# EAGLE design Maze (EAGLE 9.7.0)
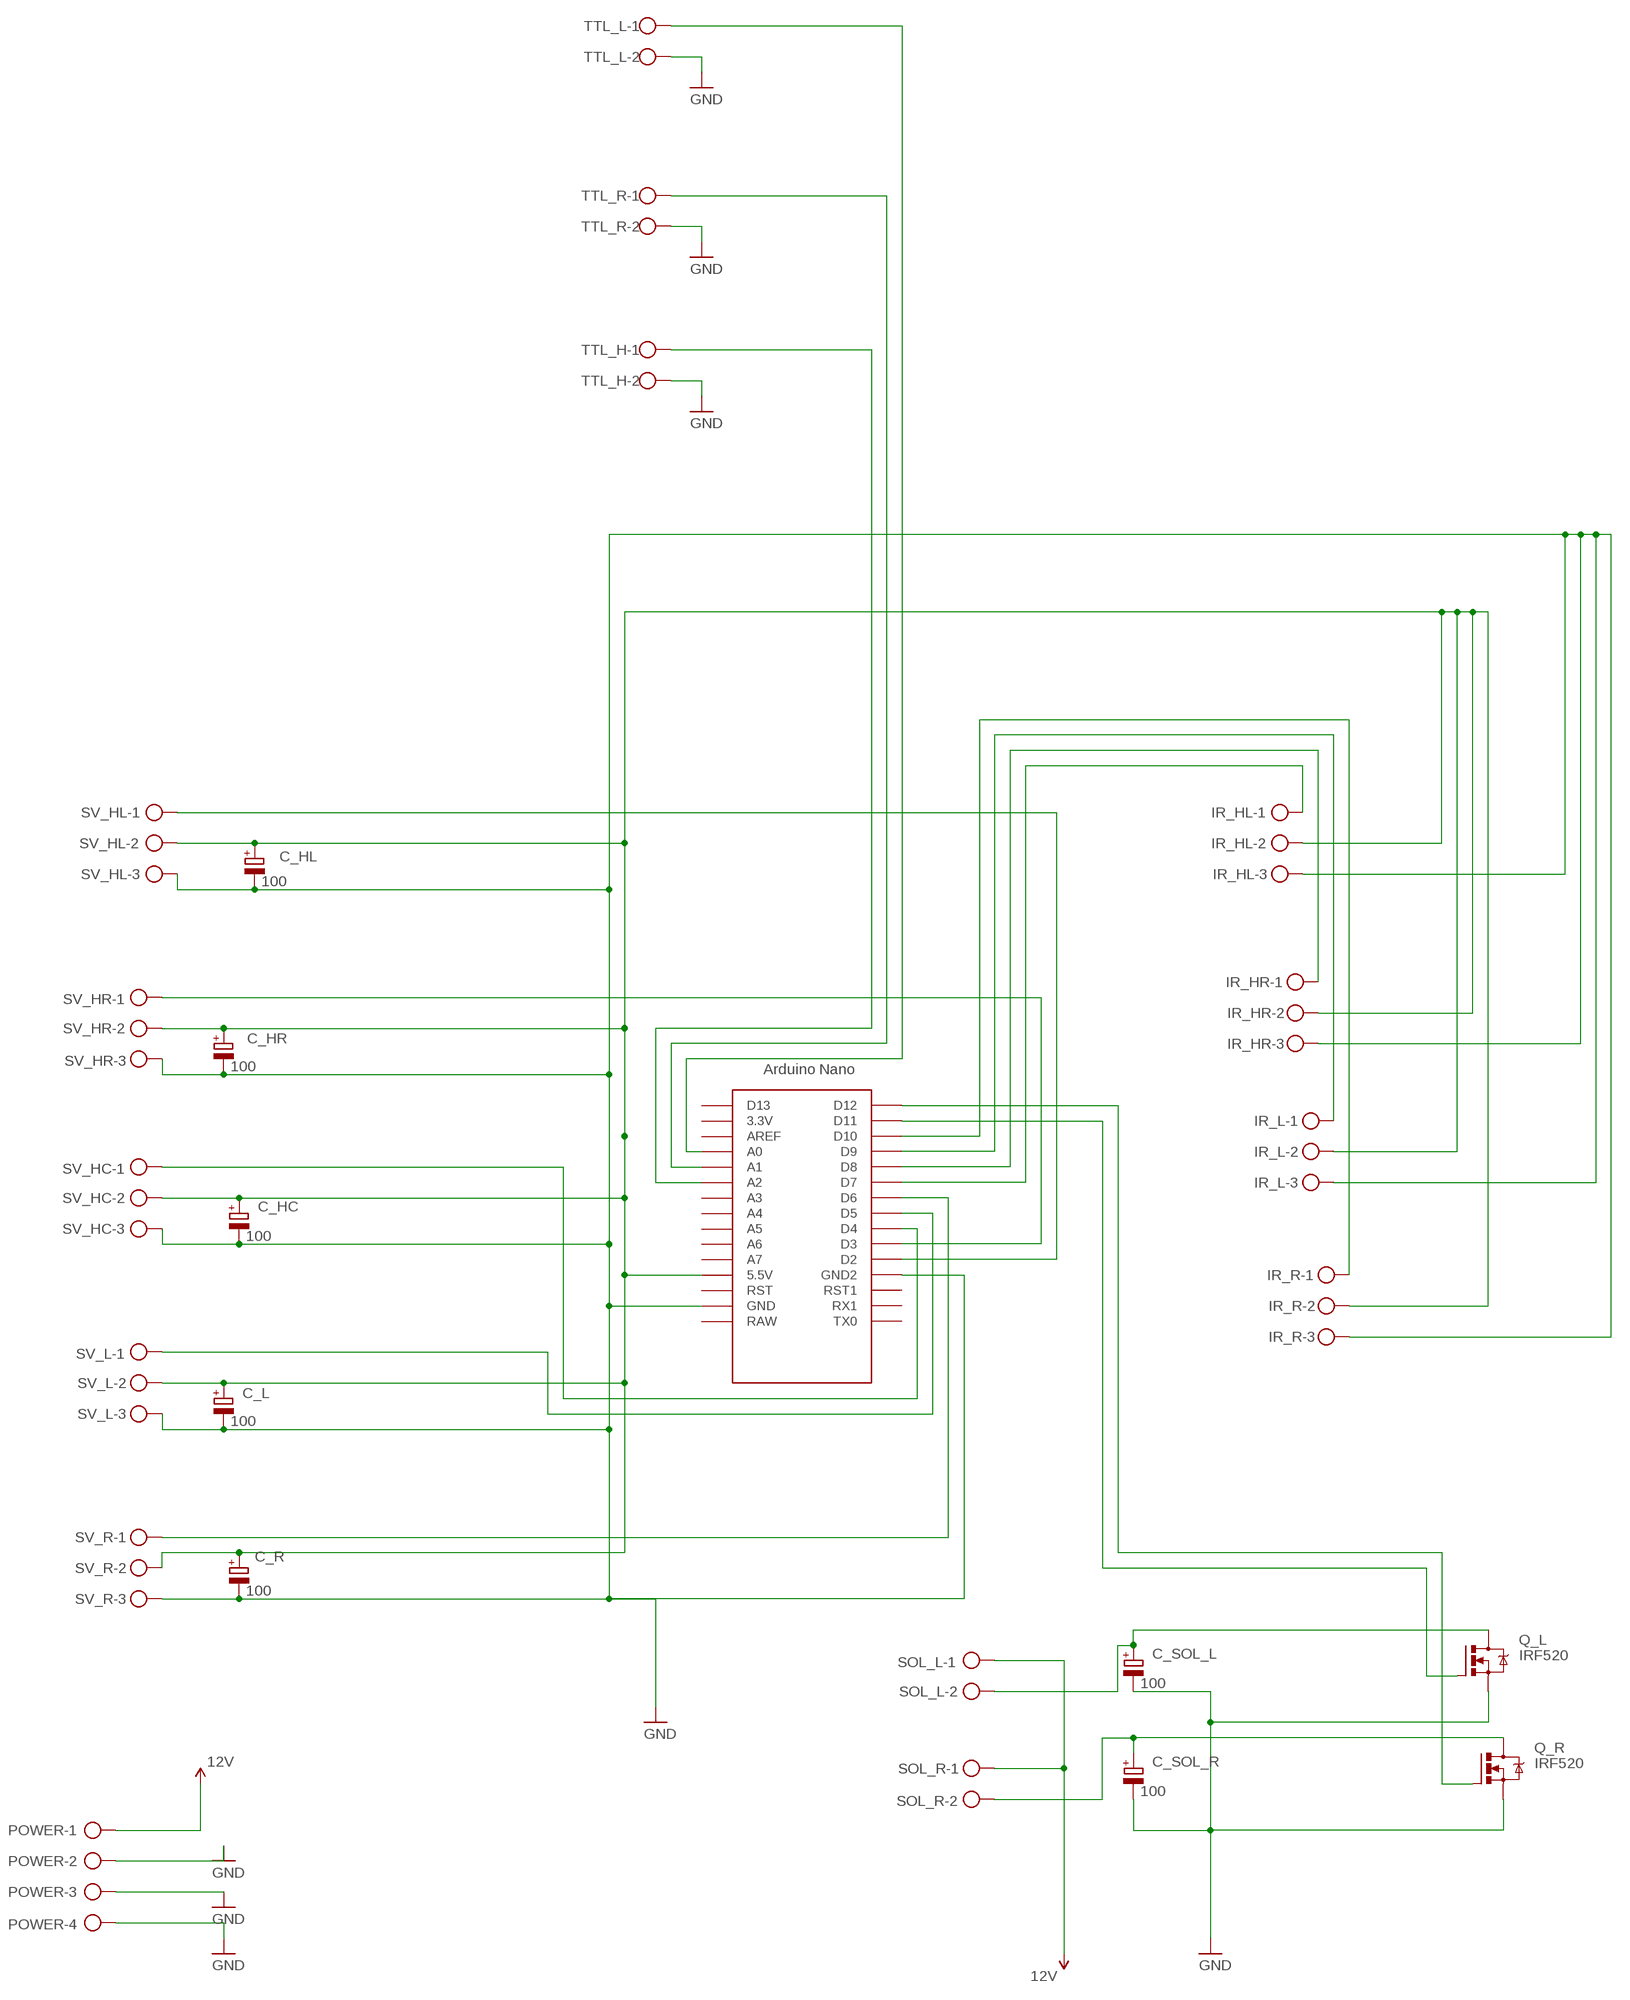
[diagram p0: schematic, sheet 1]

## Parts
C_HC  100  CPOL-EUE2.5-6  [E2,5-6]
C_HL  100  CPOL-EUE2.5-6  [E2,5-6]
C_HR  100  CPOL-EUE2.5-6  [E2,5-6]
C_L  100  CPOL-EUE2.5-6  [E2,5-6]
C_R  100  CPOL-EUE2.5-6  [E2,5-6]
C_SOL_L  100  CPOL-EUE2.5-6  [E2,5-6]
C_SOL_R  100  CPOL-EUE2.5-6  [E2,5-6]
IR_HL  W237-103  [W237-103]
IR_HR  W237-103  [W237-103]
IR_L  W237-103  [W237-103]
IR_R  W237-103  [W237-103]
POWER  W237-4  [W237-4]
Q_L  IRF520  [TO220BV]
Q_R  IRF520  [TO220BV]
SOL_L  W237-102  [W237-102]
SOL_R  W237-102  [W237-102]
SV_HC  W237-103  [W237-103]
SV_HL  W237-103  [W237-103]
SV_HR  W237-103  [W237-103]
SV_L  W237-103  [W237-103]
SV_R  W237-103  [W237-103]
TTL_H  W237-102  [W237-102]
TTL_L  W237-102  [W237-102]
TTL_R  W237-102  [W237-102]
U$1  NANO  [NANO]

## Nets
12V: POWER.1 SOL_L.1 SOL_R.1
GND: C_HC.- C_HL.- C_HR.- C_L.- C_R.- C_SOL_L.- C_SOL_R.- IR_HL.3 IR_HR.3 IR_L.3 IR_R.3 POWER.2 POWER.3 POWER.4 Q_L.S Q_R.S SV_HC.3 SV_HL.3 SV_HR.3 SV_L.3 SV_R.3 TTL_H.2 TTL_L.2 TTL_R.2 U$1.GND U$1.GND1(GND2)
N$1: SV_HL.1 U$1.D2
N$2: SV_HC.1 U$1.D4
N$3: SV_R.1 U$1.D6
N$4: SV_HR.1 U$1.D3
N$5: SV_L.1 U$1.D5
N$6: IR_HL.1 U$1.D7
N$7: C_HC.+ C_HL.+ C_HR.+ C_L.+ C_R.+ IR_HL.2 IR_HR.2 IR_L.2 IR_R.2 SV_HC.2 SV_HL.2 SV_HR.2 SV_L.2 SV_R.2 U$1.5V(5.5V)
N$8: IR_HR.1 U$1.D8
N$9: IR_L.1 U$1.D9
N$10: IR_R.1 U$1.D10
N$11: C_SOL_L.+ Q_L.D SOL_L.2
N$12: Q_L.G U$1.D11
N$13: C_SOL_R.+ Q_R.D SOL_R.2
N$14: Q_R.G U$1.D12
N$15: TTL_L.1 U$1.A0
N$16: TTL_R.1 U$1.A1
N$17: TTL_H.1 U$1.A2
Unconnected: U$1.3.3V U$1.A3 U$1.A4 U$1.A5 U$1.A6 U$1.A7 U$1.AREF U$1.D13 U$1.ICSP1 U$1.ICSP2 U$1.ICSP3 U$1.ICSP4 U$1.ICSP5 U$1.ICSP6 U$1.RAW U$1.RST U$1.RST1 U$1.RX1 U$1.TX0

## Library data of the parts
C_HC C_HL C_HR C_L C_R C_SOL_L C_SOL_R = rcl:CPOL-EU: POLARIZED CAPACITOR, European symbol; SPICEPREFIX: C
IR_HL IR_HR IR_L IR_R SV_HC SV_HR SV_L SV_R = con-wago-500:W237-103: WAGO SCREW CLAMP; MPN: 237-103; OC_FARNELL: unknown; OC_NEWARK: 18M7116
POWER = con-wago-500:W237-4: WAGO SCREW CLAMP; OC_FARNELL: unknown; OC_NEWARK: unknown
Q_L Q_R = transistor-power:IRF520: HEXFET Power MOSFET
SOL_L SOL_R TTL_H TTL_L TTL_R = con-wago-500:W237-102: WAGO SCREW CLAMP; MPN: 237-102; OC_FARNELL: unknown; OC_NEWARK: 70K9898
SV_HL = con-wago-500:W237-103: WAGO SCREW CLAMP; MPN: 237-103; OC_FARNELL: unknown; OC_NEWARK: 18M7116; SPICEPREFIX: X
U$1 = Arduino-clone:NANO: Arduino Nano

## Board
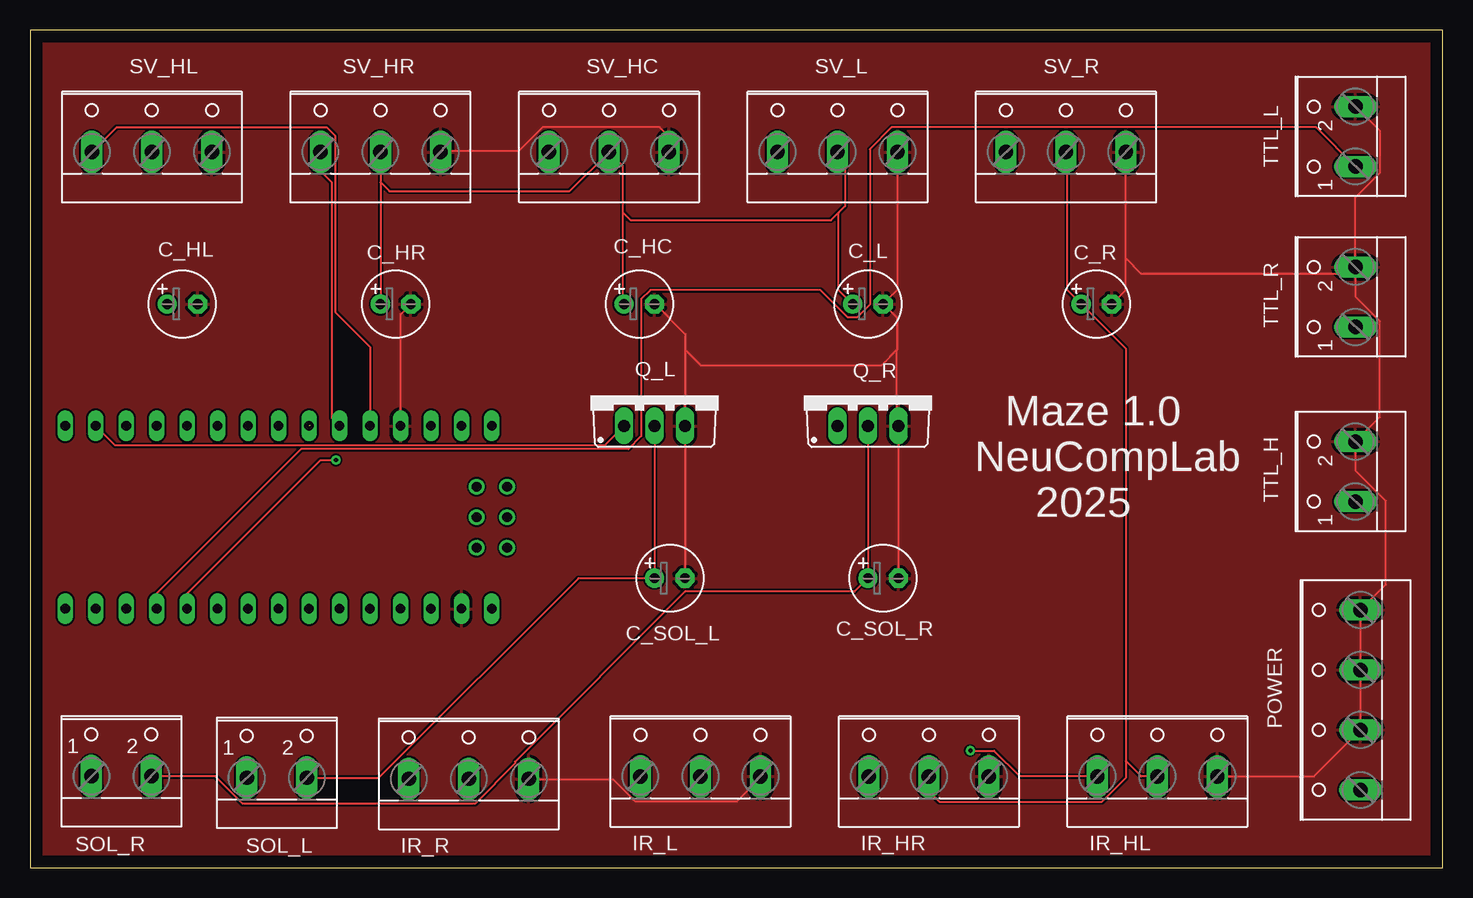
[diagram p1: board, top side]
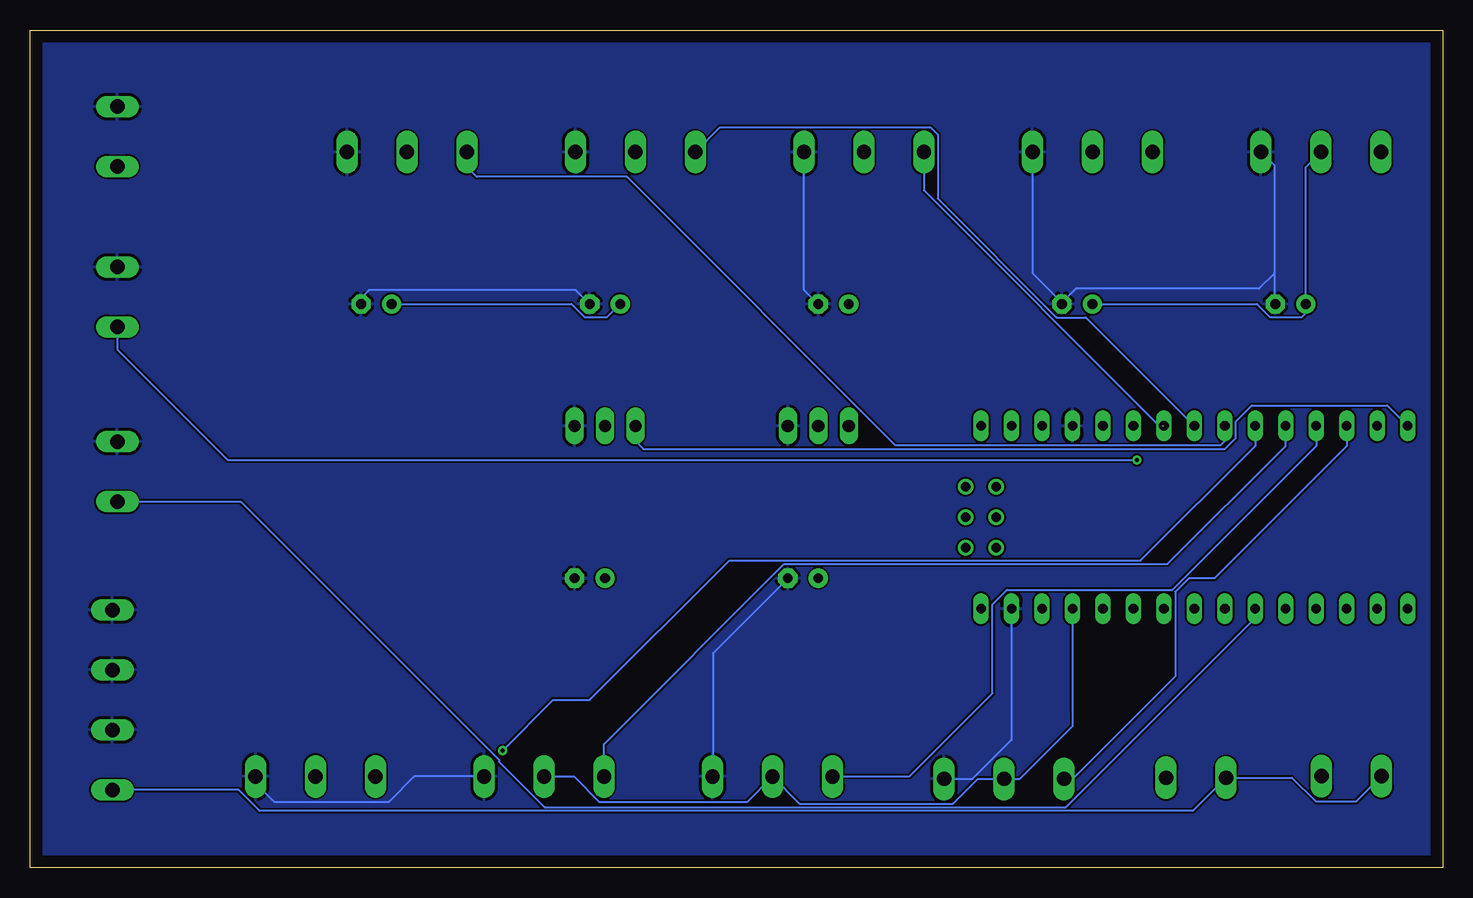
[diagram p2: board, bottom side, seen from below]

Size 117.78 x 69.84 mm. Coordinates in mm from the lower left corner, seen from the top.
Outline: 0,0 117.78,0 117.78,69.84 0,69.84 0,0
Copper layers (1*16): Top 0.035mm / dielectric 1.5mm / Bottom 0.035mm
Design rules "Fusion Electronics Design Rules": minimum track width 6mil, minimum drill 0.35mm, track to track 6mil, track to pad 6mil, pad to pad 6mil, via to via 6mil, smd to smd 6mil, copper to edge 40mil, drill to drill 6mil, minimum pad ring 10mil, minimum via ring 8mil, stop-mask expansion 4mil, vias tented up to drill 9999mil, thermal gap 10mil

### Footprints (pad centres in the part's own frame; a part is rotated, then mirrored left to right if it is on the bottom)
E2,5-6 = drill 0.813 pad 1.6: + -1.27,0 | drill 0.813 pad 1.6 octagon: - 1.27,0
W237-103 = drill 1.194 long: 1 -5,-1.29; 2 0,-1.29; 3 5,-1.29
W237-4 = drill 1.194 long: 1 -7.5,-1.27; 2 -2.5,-1.27; 3 2.5,-1.27; 4 7.5,-1.27
TO220BV = drill 1.016 long: D 0,-2.54; G -2.54,-2.54; S 2.54,-2.54
W237-102 = drill 1.194 long: 1 -2.5,-1.27; 2 2.5,-1.27
NANO = drill 0.8 long: 3.3V -10.16,24.13; 5V -10.16,-1.27; A0 -10.16,19.05; A1 -10.16,16.51; A2 -10.16,13.97; A3 -10.16,11.43; A4 -10.16,8.89; A5 -10.16,6.35; A6 -10.16,3.81; A7 -10.16,1.27; AREF -10.16,21.59; D2 5.08,1.27; D3 5.08,3.81; D4 5.08,6.35; D5 5.08,8.89; D6 5.08,11.43; D7 5.08,13.97; D8 5.08,16.51; D9 5.08,19.05; D10 5.08,21.59; D11 5.08,24.13; D12 5.08,26.67; D13 -10.16,26.67; GND -10.16,-6.35; GND1 5.08,-1.27; RAW -10.16,-8.89; RST -10.16,-3.81; RST1 5.08,-3.81; RX1 5.08,-6.35; TX0 5.08,-8.89 | drill 0.8: ICSP1 -5.08,-10.16; ICSP2 -5.08,-7.62; ICSP3 -2.54,-10.16; ICSP4 -2.54,-7.62; ICSP5 0,-10.16; ICSP6 0,-7.62

### Placement (x,y rotation side)
C_HC  50.8,46.99 0 top
C_HL  12.7,46.99 0 top
C_HR  30.48,46.99 0 top
C_L  69.85,46.99 0 top
C_R  88.9,46.99 0 top
C_SOL_L  53.34,24.13 0 top
C_SOL_R  71.12,24.13 0 top
IR_HL  93.98,8.89 0 top
IR_HR  74.93,8.89 0 top
IR_L  55.88,8.89 0 top
IR_R  36.58,8.69 0 top
POWER  109.64,13.97 90 top
Q_L  52.07,39.37 0 top
Q_R  69.85,39.37 0 top
SOL_L  20.57,8.76 0 top
SOL_R  7.62,8.89 0 top
SV_HC  48.26,60.96 0 top
SV_HL  10.16,60.96 0 top
SV_HR  29.21,60.96 0 top
SV_L  67.31,60.96 0 top
SV_R  86.36,60.96 0 top
TTL_H  109.22,33.02 90 top
TTL_L  109.22,60.96 90 top
TTL_R  109.22,47.58 90 top
U$1  29.61,31.75 90 top

### Tracks (layer width: path | path; a pad name or v marks a point on that pad's centre or on a via)
12V
  Bottom 0.152: POWER.1 100.4,6.47 98.65,4.72 20.84,4.72 SOL_L.1 12.57,7.49 10.57,5.49 7.25,5.49 SOL_R.1
GND
  Top 0.152: 72.29,43.18 72.29,45.87 71.22,46.94 C_L.- 72.31,48.18 SV_L.3 | 91.34,50.8 91.34,48.16 C_R.- | 91.34,50.8 91.34,59.59 SV_R.3 | IR_R.3 41.66,7.32 48.67,7.32 50.49,5.49 58.88,5.49 60.86,7.47 IR_L.3 | 54.61,43.18 54.61,44.5 52.17,46.94 C_HC.- | 54.61,43.18 Q_L.S C_SOL_L.- | SV_HR.3 34.34,59.74 40.74,59.74 42.72,61.72 52.5,61.72 53.26,60.96 SV_HC.3 | U$1.GND1 30.88,46.12 C_HR.- | TTL_L.2 112.52,61.43 112.52,57.91 110.49,55.88 TTL_R.2 | 91.34,50.8 92.61,49.53 109.94,49.53 TTL_R.2 | TTL_R.2 110.49,47.6 112.52,45.57 112.52,37.55 TTL_H.2 110.49,33.12 113.03,30.58 113.03,23.59 POWER.4 POWER.3 POWER.2 107.04,7.6 IR_HL.3 | 54.61,43.18 55.88,41.91 71.02,41.91 72.29,43.18 | 72.29,43.18 72.29,36.93 Q_R.S C_SOL_R.-
  Bottom 0.152: 14.07,49.53 14.07,58.58 SV_HL.3 | 14.07,49.53 14.07,47.09 C_HL.- | 31.75,47.09 34.21,49.55 SV_HR.3 | 31.75,47.09 30.58,48.26 15.34,48.26 14.07,49.53 | 31.75,47.09 C_HR.- | IR_L.3 60.86,7.62 60.86,17.88 C_SOL_L.- | C_HC.- 53.24,48.16 53.24,59.59 SV_HC.3 | C_L.- 72.29,48.16 89.51,48.16 90.17,47.5 C_R.- | IR_HL.3 98.98,7.03 97.43,5.49 87.86,5.49 85.74,7.6 IR_HR.3 | U$1.GND 35.96,10.65 39.21,7.4 IR_R.3
  pour Top: 0.08,0.08 117.78,0.08 117.78,69.77 0.08,69.77
  pour Bottom: 0.08,0.08 117.78,0.08 117.78,69.77 0.08,69.77
N$1
  Top 0.152: SV_HL.1 7.21,61.72 24.74,61.72 25.45,61.01 25.45,46.3 28.34,43.41 U$1.D2
N$2  (1 unrouted)
  Bottom 0.152: 23.37,36.88 23.67,36.88 43.26,56.47 SV_HC.1
N$3
  Bottom 0.152: U$1.D6 18.18,35.56 18.54,35.2 45.62,35.2 68.02,57.61 80.55,57.61 81.36,58.42 SV_R.1
N$4
  Top 0.152: U$1.D3 25.15,37.48 25.15,57.15 24.21,58.09 SV_HR.1
N$5
  Bottom 0.152: U$1.D5 29.76,45.87 32.21,45.87 42.11,55.78 42.11,61.11 42.72,61.72 60.26,61.72 SV_L.1
N$6  (via drill 0.35)
  Top 0.152: v78.38,9.75 80.37,9.75 82.52,7.6 IR_HL.1
  Bottom 0.152: v78.38,9.75 74.17,13.97 71.12,13.97 59.49,25.6 25.2,25.6 15.64,35.16 U$1.D7
N$7
  Top 0.152: 67.41,54.61 67.41,48.16 C_L.+ | SV_R.2 86.46,59.59 86.46,48.16 C_R.+ 91.34,43.28 91.34,8.89 | 91.34,8.89 91.34,7.47 89.36,5.49 75.79,5.49 74.93,6.35 IR_HR.2 | SV_HR.2 29.21,57.15 | 29.21,57.15 C_HR.+ | 29.21,57.15 29.97,56.39 44.98,56.39 SV_HC.2 49.43,58.5 49.43,54.61 | C_HC.+ 49.43,47.09 49.43,54.61 | 49.43,54.61 50.06,53.98 66.78,53.98 67.41,54.61 | IR_HL.2 92.63,7.6 91.34,8.89 | SV_L.2 67.94,59.03 67.94,55.14 67.41,54.61
  Bottom 0.152: C_L.+ 69.7,45.87 71.53,45.87 72.64,46.99 C_R.+ | SV_HL.2 11.43,58.4 C_HL.+ 11.43,46.23 11.79,45.87 14.38,45.87 15.49,46.99 C_HR.+ | IR_HR.2 72.42,7.6 70.28,5.46 58.02,5.46 IR_L.2 53.61,5.33 40.84,5.33 38.78,7.4 IR_R.2 35.27,7.4 30.86,11.81 30.86,13.04 30.88,13.06 U$1.5V
N$8
  Bottom 0.152: U$1.D8 13.1,35.16 22.96,25.3 54.91,25.3 69.93,10.28 IR_HR.1
N$9
  Bottom 0.152: U$1.D9 10.56,35.16 22.55,23.16 36.32,23.16 37.54,21.95 37.54,14.53 44.47,7.6 IR_L.1
N$10
  Bottom 0.152: U$1.D10 8.02,35.16 19.05,24.13 21.16,24.13 22.3,22.99 22.3,15.93 30.83,7.4 IR_R.1
N$11
  Top 0.152: Q_L.D C_SOL_L.+ 45.72,24.13 29.08,7.49 SOL_L.2
N$12
  Top 0.152: Q_L.G 47.9,35.2 7.11,35.2 U$1.D11
N$13
  Top 0.152: SOL_R.2 15.44,7.62 17.73,5.33 37.08,5.33 40.44,8.69 40.44,8.84 54.61,23.01 68.73,23.01 C_SOL_R.+ Q_R.D
N$14
  Bottom 0.152: U$1.D12 4.64,38.53 15.92,38.53 17.27,37.19 17.27,35.81 18.19,34.9 66.65,34.9 67.31,35.56 Q_R.G
N$15
  Top 0.152: TTL_L.1 107.23,61.72 71.83,61.72 70,59.89 70,46.94 68.94,45.87 68.17,45.87 65.89,48.16 51.71,48.16 50.95,47.4 50.95,35.97 49.89,34.9 22.6,34.9 10.56,22.86 U$1.A0
N$16  (via drill 0.35)
  Top 0.152: U$1.A1 13.1,22.86 24.22,33.98 v25.5,33.98
  Bottom 0.152: v25.5,33.98 101.29,33.98 110.49,43.18 TTL_R.1
N$17
  Bottom 0.152: U$1.A2 15.64,20.83 31.44,5.03 74.88,5.03 78.69,8.84 78.69,8.99 100.22,30.52 TTL_H.1

### Text on the board
tPlace: Maze 1.0 | NeuCompLab | 2025